# Altium schematic sheet Power.SchDoc
size A3; Description: Power Subsystem; Version: 1.0
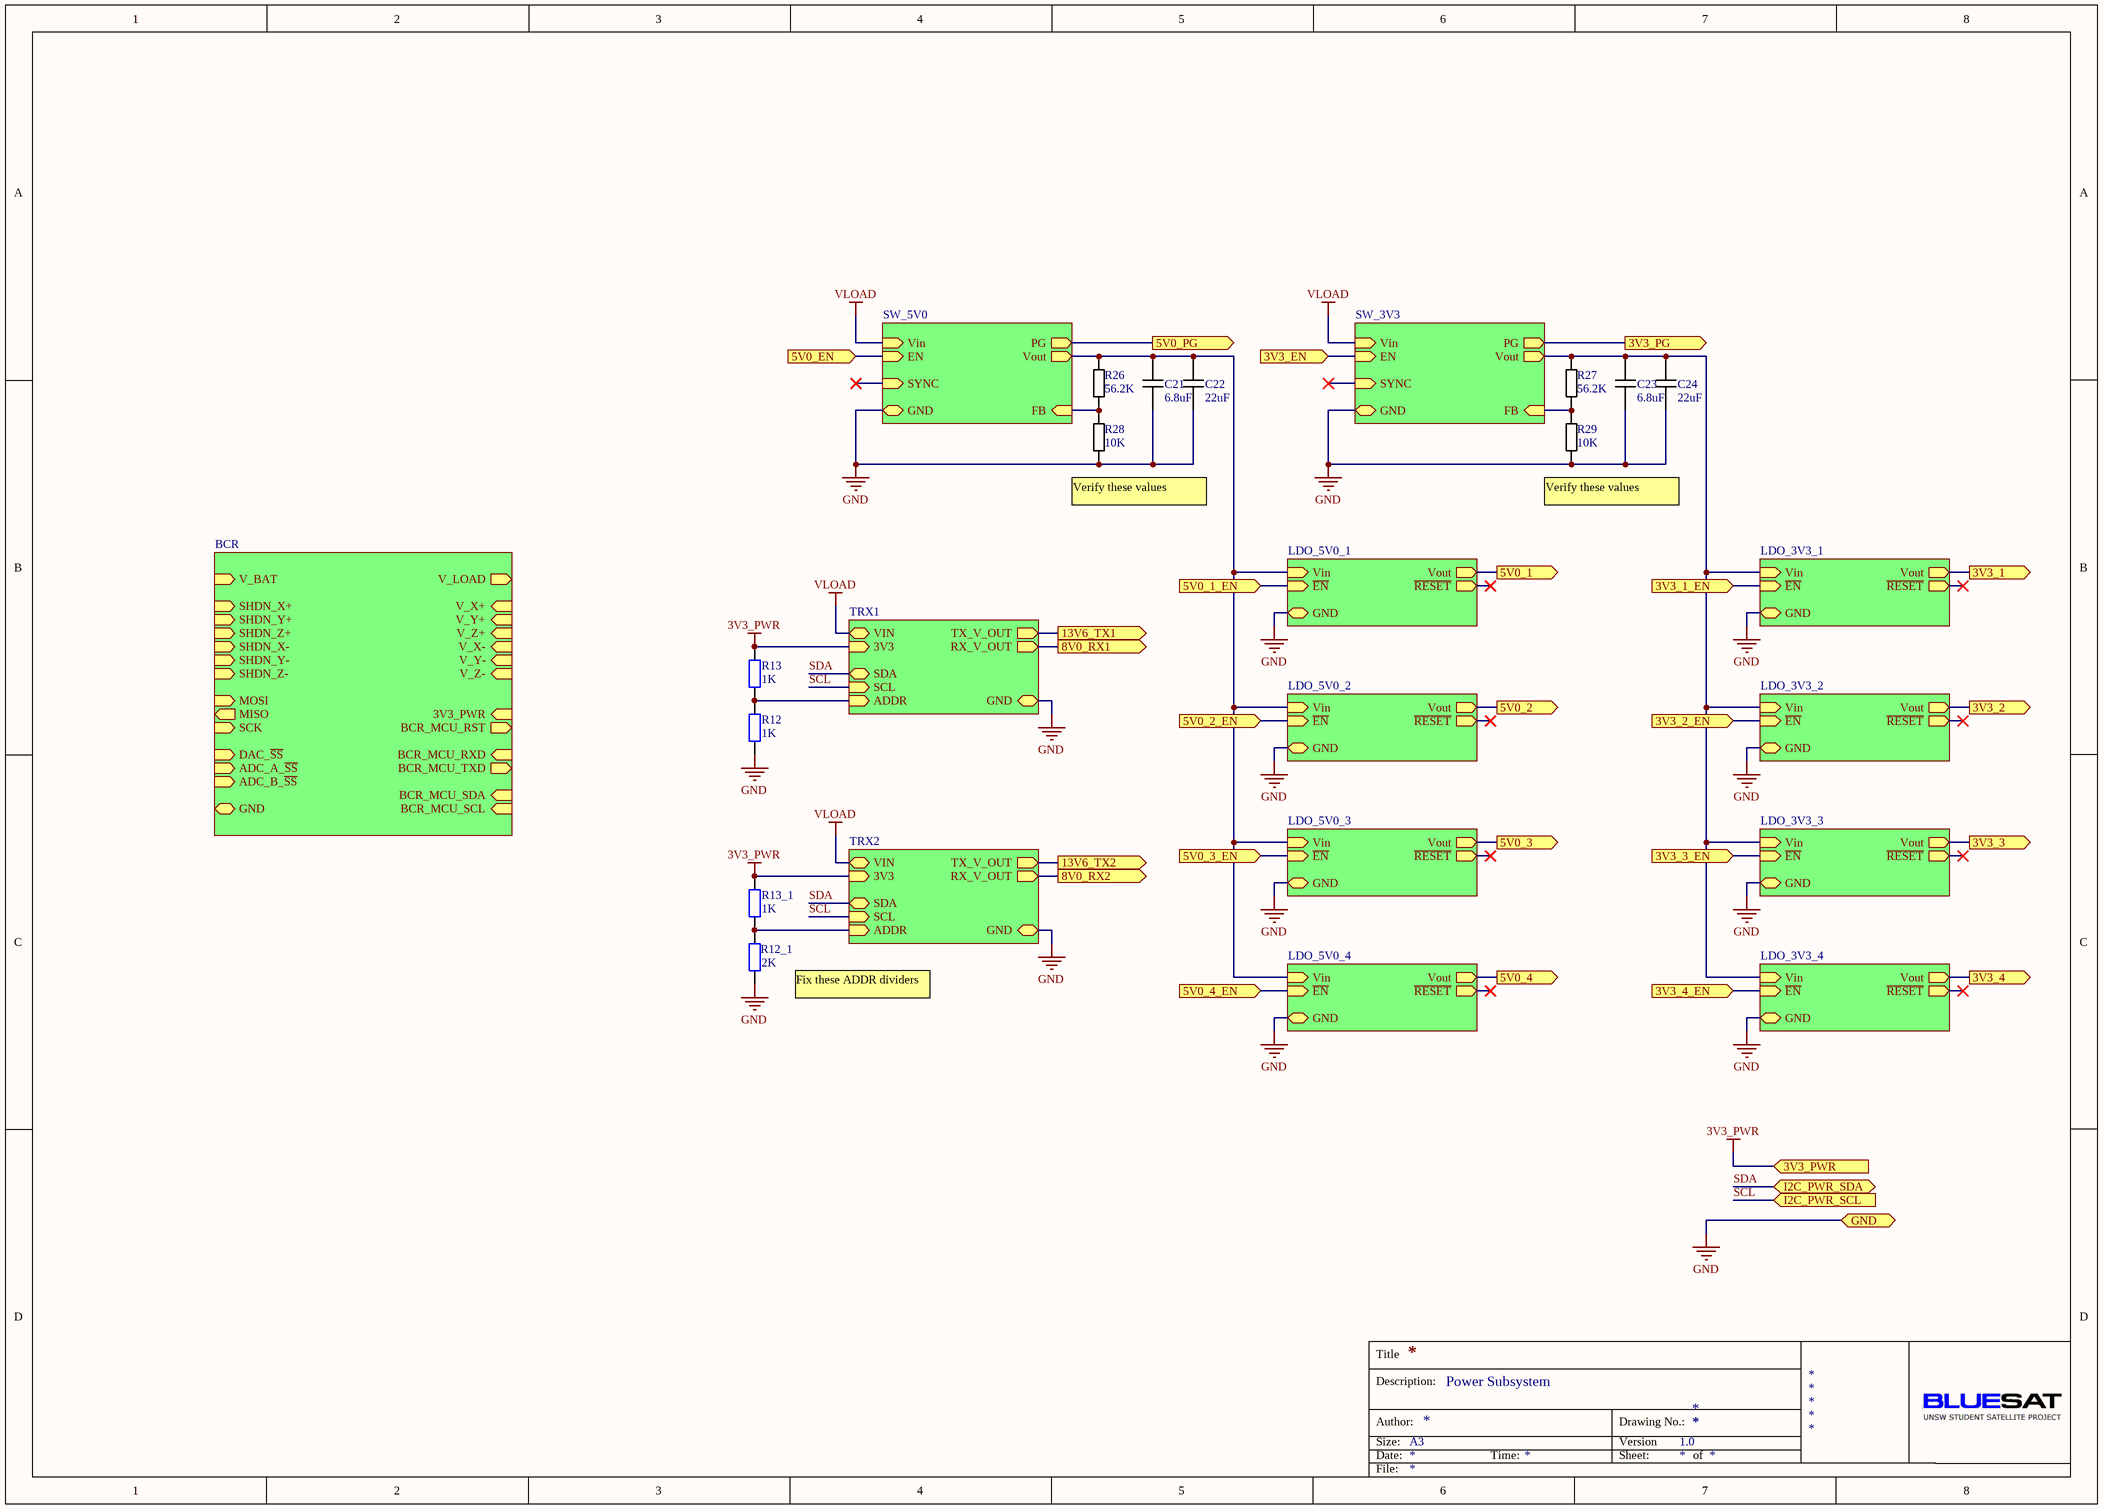
[diagram p0: Power.SchDoc]

## Parts
C21  value 6.8uF  [0805 Cap]  (hidden comment: 0805 Cap)
C22  value 22uF  [1206 Cap]  (hidden comment: 1206 Cap)
C23  value 6.8uF  [0805 Cap]  (hidden comment: 0805 Cap)
C24  value 22uF  [1206 Cap]  (hidden comment: 1206 Cap)
R12  value 1K  [R0805M]  (hidden comment: Res2)
R12_1  value 2K  [R0805M]  (hidden comment: Res2)
R13  value 1K  [R0805M]  (hidden comment: Res2)
R13_1  value 1K  [R0805M]  (hidden comment: Res2)
R26  value 56.2K  [0805 Resistor]  (hidden comment: 0805 Resistor)
R27  value 56.2K  [0805 Resistor]  (hidden comment: 0805 Resistor)
R28  value 10K  [0805 Resistor]  (hidden comment: 0805 Resistor)
R29  value 10K  [0805 Resistor]  (hidden comment: 0805 Resistor)

## Sub-sheets
BCR = BCR.SchDoc: 3V3_PWR (in), V_BAT (in), V_LOAD (out), V_X+ (in), V_Y+ (in), V_Z+ (in), V_X- (in), V_Y- (in), V_Z- (in), SHDN_X+ (in), SHDN_Y+ (in), SHDN_Z+ (in), SHDN_X- (in), SHDN_Y- (in), SHDN_Z- (in), MOSI (in), MISO (out), SCK (in), DAC_~{SS} (in), ADC_A_~{SS} (in), ADC_B_~{SS} (in), BCR_MCU_SDA (in), BCR_MCU_SCL (in), BCR_MCU_RXD (in), BCR_MCU_TXD (out), BCR_MCU_RST (out), GND
LDO_3V3_1 = LDO_Regulator.SchDoc: Vout (out), ~{EN} (in), ~{RESET} (out), Vin (in), GND
LDO_3V3_2 = LDO_Regulator.SchDoc: Vout (out), ~{EN} (in), ~{RESET} (out), Vin (in), GND
LDO_3V3_3 = LDO_Regulator.SchDoc: Vout (out), ~{EN} (in), ~{RESET} (out), Vin (in), GND
LDO_3V3_4 = LDO_Regulator.SchDoc: Vout (out), ~{EN} (in), ~{RESET} (out), Vin (in), GND
LDO_5V0_1 = LDO_Regulator.SchDoc: Vout (out), ~{EN} (in), ~{RESET} (out), Vin (in), GND
LDO_5V0_2 = LDO_Regulator.SchDoc: Vout (out), ~{EN} (in), ~{RESET} (out), Vin (in), GND
LDO_5V0_3 = LDO_Regulator.SchDoc: Vout (out), ~{EN} (in), ~{RESET} (out), Vin (in), GND
LDO_5V0_4 = LDO_Regulator.SchDoc: Vout (out), ~{EN} (in), ~{RESET} (out), Vin (in), GND
SW_3V3 = SW_Regulator.SchDoc: PG (out), Vout (out), EN (in), Vin (in), SYNC (in), GND, FB (in)
SW_5V0 = SW_Regulator.SchDoc: PG (out), Vout (out), EN (in), Vin (in), SYNC (in), GND, FB (in)
TRX1 = TRX_Regulator.SchDoc: VIN, TX_V_OUT (out), RX_V_OUT (out), 3V3 (in), SCL (in), SDA (bidir), GND, ADDR (in)
TRX2 = TRX_Regulator.SchDoc: VIN, TX_V_OUT (out), RX_V_OUT (out), 3V3 (in), SCL (in), SDA (bidir), GND, ADDR (in)

## Ports
3V3_1 (out), 3V3_1_EN (in), 3V3_2 (out), 3V3_2_EN (in), 3V3_3 (out), 3V3_3_EN (in), 3V3_4 (out), 3V3_4_EN (in), 3V3_EN (in), 3V3_PG (out), 3V3_PWR (in), 5V0_1 (out), 5V0_1_EN (in), 5V0_2 (out), 5V0_2_EN (in), 5V0_3 (out), 5V0_3_EN (in), 5V0_4 (out), 5V0_4_EN (in), 5V0_EN (in), 5V0_PG (out), 8V0_RX1 (out), 8V0_RX2 (out), 13V6_TX1 (out), 13V6_TX2 (out), GND, I2C_PWR_SCL (in), I2C_PWR_SDA (bidir)

## Nets
3V3_PWR: R13.2 R13_1.2 ; port 3V3_PWR, sheet TRX1/3V3, sheet TRX2/3V3
GND: C21.1 C22.1 C23.1 C24.1 R12.1 R12_1.1 R28.1 R29.1 ; port GND, sheet LDO_5V0_1/GND, sheet LDO_3V3_1/GND, sheet LDO_5V0_2/GND, sheet LDO_3V3_2/GND, sheet LDO_5V0_3/GND, sheet LDO_3V3_3/GND, sheet LDO_5V0_4/GND, sheet LDO_3V3_4/GND, sheet SW_5V0/GND, sheet SW_3V3/GND, sheet TRX1/GND, sheet TRX2/GND
VLOAD: sheet SW_5V0/Vin, sheet SW_3V3/Vin, sheet TRX1/VIN, sheet TRX2/VIN
3V3_1: port 3V3_1, sheet LDO_3V3_1/Vout
3V3_1_EN: port 3V3_1_EN, sheet LDO_3V3_1/~{EN}
3V3_2: port 3V3_2, sheet LDO_3V3_2/Vout
3V3_2_EN: port 3V3_2_EN, sheet LDO_3V3_2/~{EN}
3V3_3: port 3V3_3, sheet LDO_3V3_3/Vout
3V3_3_EN: port 3V3_3_EN, sheet LDO_3V3_3/~{EN}
3V3_4: port 3V3_4, sheet LDO_3V3_4/Vout
3V3_4_EN: port 3V3_4_EN, sheet LDO_3V3_4/~{EN}
3V3_EN: port 3V3_EN, sheet SW_3V3/EN
3V3_PG: port 3V3_PG, sheet SW_3V3/PG
5V0_1: port 5V0_1, sheet LDO_5V0_1/Vout
5V0_1_EN: port 5V0_1_EN, sheet LDO_5V0_1/~{EN}
5V0_2: port 5V0_2, sheet LDO_5V0_2/Vout
5V0_2_EN: port 5V0_2_EN, sheet LDO_5V0_2/~{EN}
5V0_3: port 5V0_3, sheet LDO_5V0_3/Vout
5V0_3_EN: port 5V0_3_EN, sheet LDO_5V0_3/~{EN}
5V0_4: port 5V0_4, sheet LDO_5V0_4/Vout
5V0_4_EN: port 5V0_4_EN, sheet LDO_5V0_4/~{EN}
5V0_EN: port 5V0_EN, sheet SW_5V0/EN
5V0_PG: port 5V0_PG, sheet SW_5V0/PG
8V0_RX1: port 8V0_RX1, sheet TRX1/RX_V_OUT
8V0_RX2: port 8V0_RX2, sheet TRX2/RX_V_OUT
13V6_TX1: port 13V6_TX1, sheet TRX1/TX_V_OUT
13V6_TX2: port 13V6_TX2, sheet TRX2/TX_V_OUT
SCL: port I2C_PWR_SCL, sheet TRX1/SCL, sheet TRX2/SCL
SDA: port I2C_PWR_SDA, sheet TRX1/SDA, sheet TRX2/SDA
NetC21_2: C21.2 C22.2 R26.2 ; sheet LDO_5V0_1/Vin, sheet LDO_5V0_2/Vin, sheet LDO_5V0_3/Vin, sheet LDO_5V0_4/Vin, sheet SW_5V0/Vout
NetC23_2: C23.2 C24.2 R27.2 ; sheet LDO_3V3_1/Vin, sheet LDO_3V3_2/Vin, sheet LDO_3V3_3/Vin, sheet LDO_3V3_4/Vin, sheet SW_3V3/Vout
NetR12_1_2: R12_1.2 R13_1.1 ; sheet TRX2/ADDR
NetR12_2: R12.2 R13.1 ; sheet TRX1/ADDR
NetR26_1: R26.1 R28.2 ; sheet SW_5V0/FB
NetR27_1: R27.1 R29.2 ; sheet SW_3V3/FB

## Notes on the sheet
- (near R28) Verify these values
- (near R29) Verify these values
- (near R12_1) Fix these ADDR dividers
- Title
- Description:
- Size:
- Author:
- Date:
- A3
- Time:
- Version
- Sheet:
- Drawing No.:
- of
- File:

## Library data of the parts
C21 C23 = 0805 MLCC - X7R, 10%
C22 C24 = 1206 MLCC - X7R, 10%
R12 R12_1 R13 R13_1 = Res2: Resistor; Published: 8-Jun-2000; LatestRevisionDate: 17-Jul-2002; LatestRevisionNote: Re-released for DXP Platform.; PackageReference: AXIAL-0.4; Publisher: Altium Limited
R26-R29 = 0805 Thick Film Resistor 1%